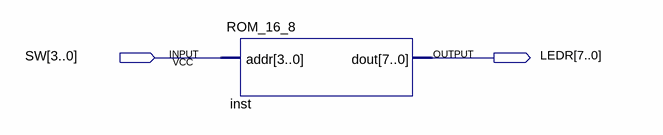
[diagram p0: schematic sheet]
// Quartus schematic ROM_Demo1.bdf as structural Verilog: 1 symbols, 2 pins
module ROM_Demo1 (
  input  [3:0] SW,
  output [7:0] LEDR
);

  ROM_16_8 inst (.addr(SW), .dout(LEDR));
endmodule
